# Altium schematic sheet Carte_Controle_Bras.SchDoc
size A3
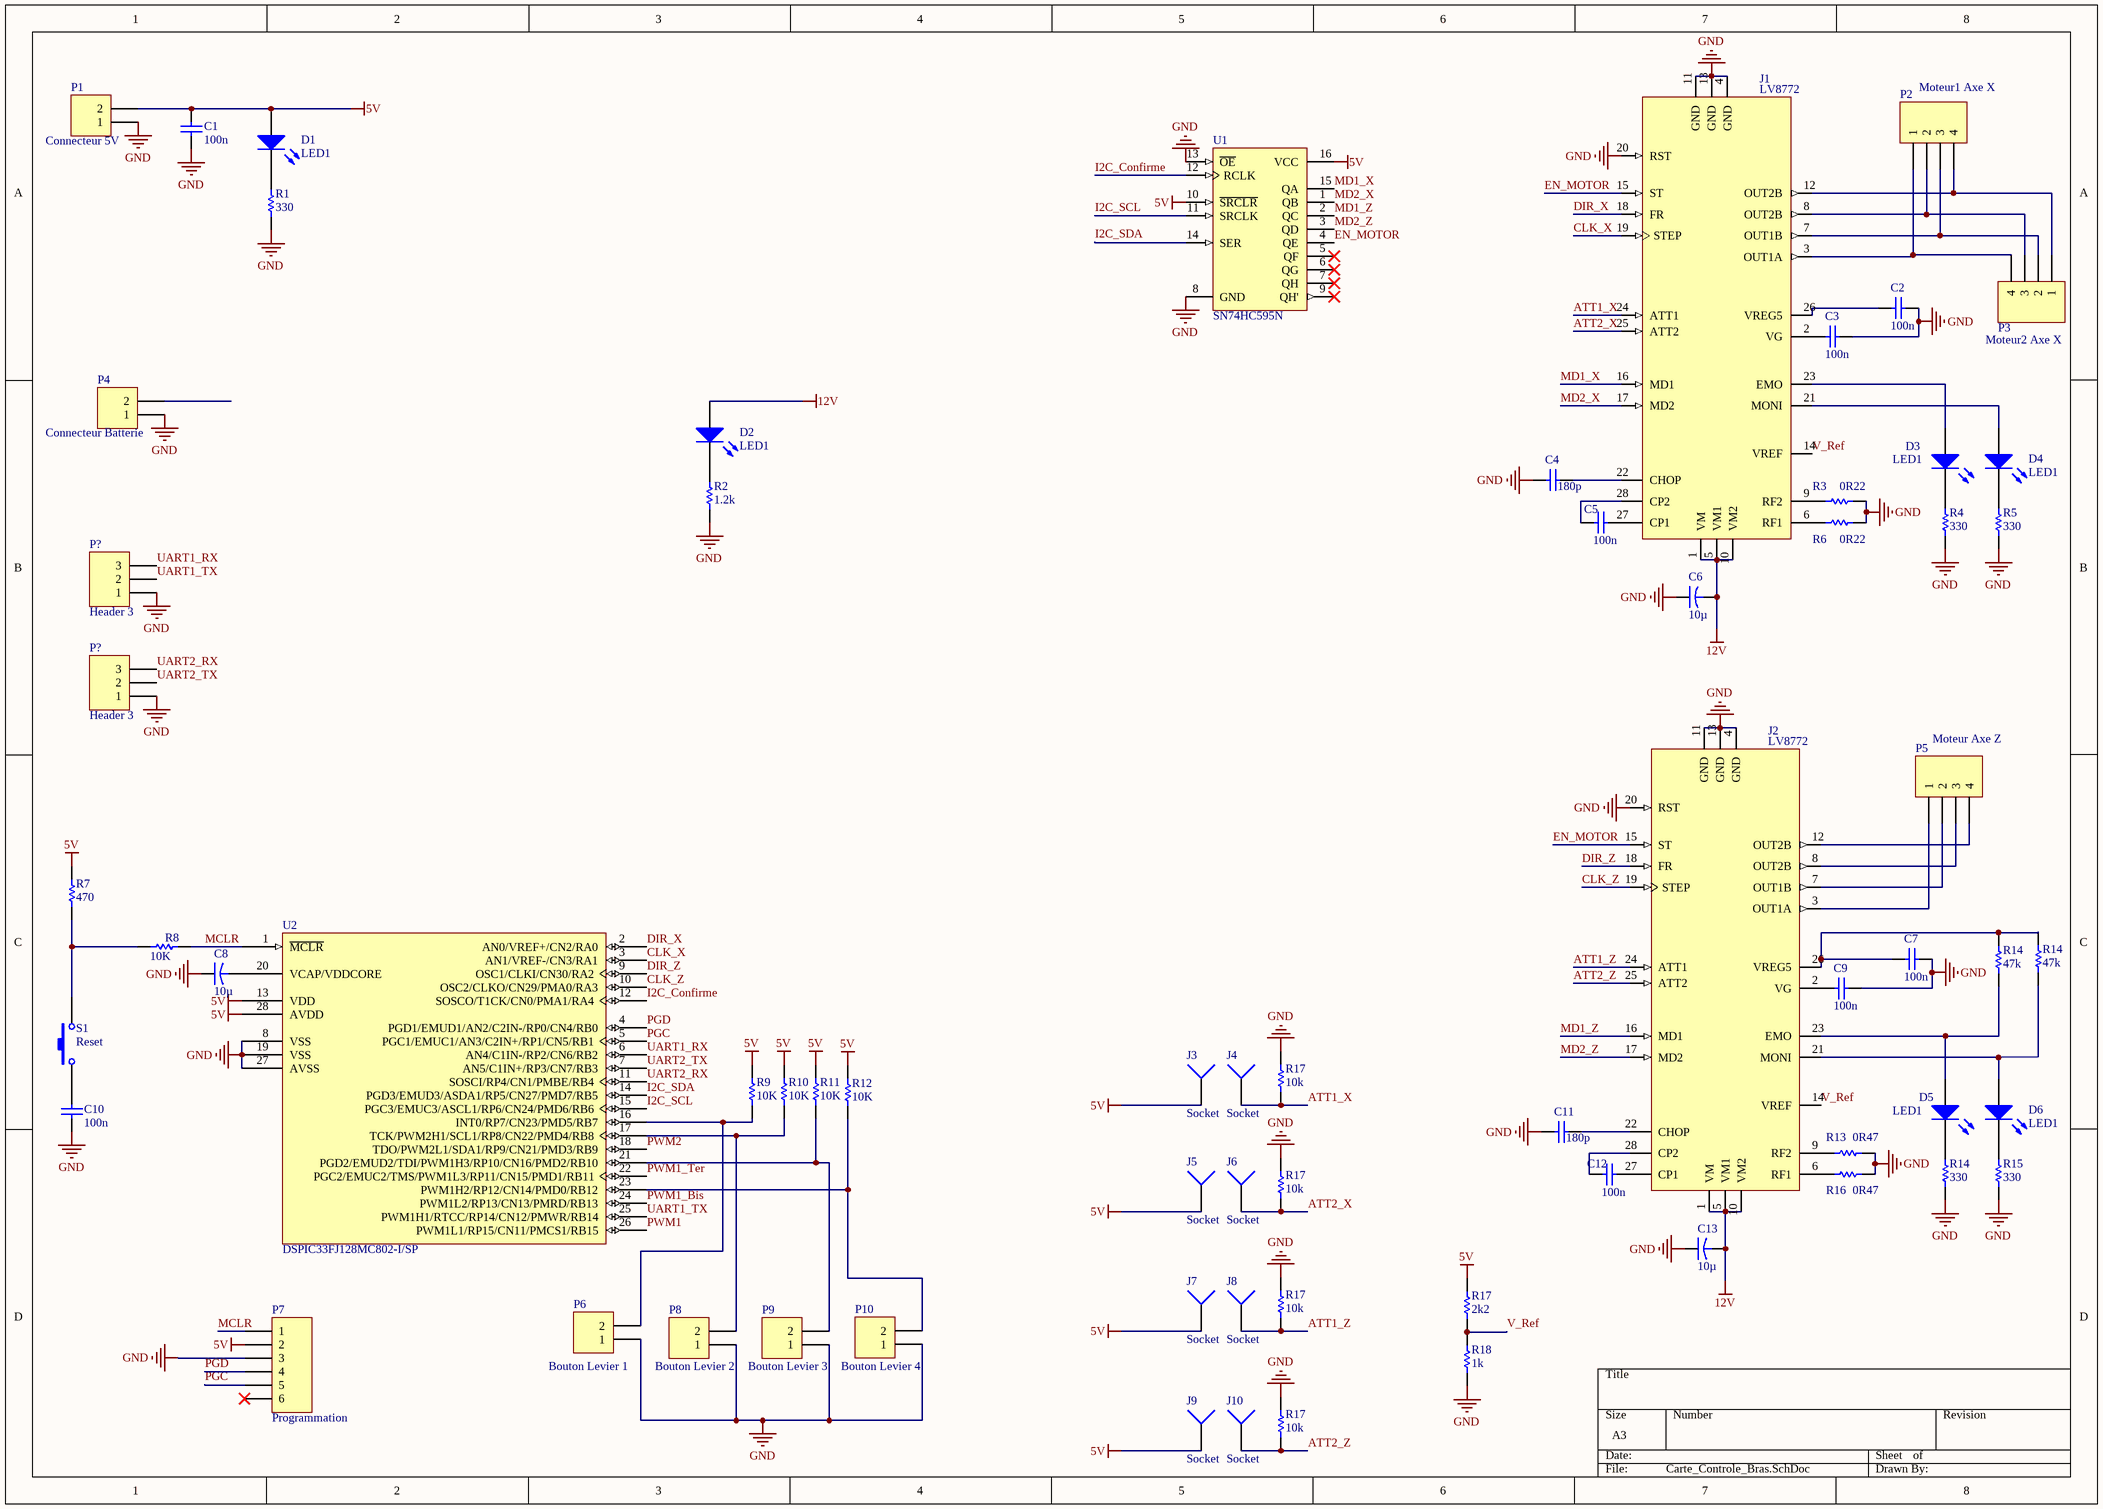
[diagram p0: Carte_Controle_Bras.SchDoc]

## Parts
(Parts that share a designator on the sheet are numbered #1, #2 ... from top to bottom, then left to right.)
C1  value 100n  [RAD-0.3]  (hidden comment: Cap)
C2  value 100n  [RAD-0.3]  (hidden comment: Cap)
C3  value 100n  [RAD-0.3]  (hidden comment: Cap)
C4  value 180p  [RAD-0.3]  (hidden comment: Cap)
C5  value 100n  [RAD-0.3]  (hidden comment: Cap)
C6  value 10µ  [CAPR5-4X5]  (hidden comment: Cap2)
C7  value 100n  [RAD-0.3]  (hidden comment: Cap)
C8  value 10µ  [CAPR5-4X5]  (hidden comment: Cap2)
C9  value 100n  [RAD-0.3]  (hidden comment: Cap)
C10  value 100n  [RAD-0.3]  (hidden comment: Cap)
C11  value 180p  [RAD-0.3]  (hidden comment: Cap)
C12  value 100n  [RAD-0.3]  (hidden comment: Cap)
C13  value 10µ  [CAPR5-4X5]  (hidden comment: Cap2)
D1  LED1  [C0805]
D2  LED1  [C0805]
D3  LED1  [C0805]
D4  LED1  [C0805]
D5  LED1  [C0805]
D6  LED1  [C0805]
J1  LV8772
J2  LV8772
J3  Socket  [PIN1]
J4  Socket  [PIN1]
J5  Socket  [PIN1]
J6  Socket  [PIN1]
J7  Socket  [PIN1]
J8  Socket  [PIN1]
J9  Socket  [PIN1]
J10  Socket  [PIN1]
P1  Connecteur 5V  [HDR1X2]
P2  Moteur1 Axe X  [HDR1X4]
P3  Moteur2 Axe X  [HDR1X4]
P4  Connecteur Batterie  [HDR1X2]
P5  Moteur Axe Z  [HDR1X4]
P6  Bouton Levier 1  [HDR1X2]
P7  Programmation  [HDR1X6]
P8  Bouton Levier 2  [HDR1X2]
P9  Bouton Levier 3  [HDR1X2]
P10  Bouton Levier 4  [HDR1X2]
P?#1  Header 3  [HDR1X3]
P?#2  Header 3  [HDR1X3]
R1  value 330  [AXIAL-0.3]  (hidden comment: Res1)
R2  value 1.2k  [AXIAL-0.3]  (hidden comment: Res1)
R3  value 0R22  [AXIAL-0.3]  (hidden comment: Res1)
R4  value 330  [AXIAL-0.3]  (hidden comment: Res1)
R5  value 330  [AXIAL-0.3]  (hidden comment: Res1)
R6  value 0R22  [AXIAL-0.3]  (hidden comment: Res1)
R7  value 470  [AXIAL-0.3]  (hidden comment: Res1)
R8  value 10K  [AXIAL-0.3]  (hidden comment: Res1)
R9  value 10K  [AXIAL-0.3]  (hidden comment: Res1)
R10  value 10K  [AXIAL-0.3]  (hidden comment: Res1)
R11  value 10K  [AXIAL-0.3]  (hidden comment: Res1)
R12  value 10K  [AXIAL-0.3]  (hidden comment: Res1)
R13  value 0R47  [AXIAL-0.3]  (hidden comment: Res1)
R14#1  value 47k  [AXIAL-0.3]  (hidden comment: Res1)
R14#2  value 47k  [AXIAL-0.3]  (hidden comment: Res1)
R14#3  value 330  [AXIAL-0.3]  (hidden comment: Res1)
R15  value 330  [AXIAL-0.3]  (hidden comment: Res1)
R16  value 0R47  [AXIAL-0.3]  (hidden comment: Res1)
R17#1  value 10k  [AXIAL-0.3]  (hidden comment: Res1)
R17#2  value 10k  [AXIAL-0.3]  (hidden comment: Res1)
R17#3  value 10k  [AXIAL-0.3]  (hidden comment: Res1)
R17#4  value 2k2  [AXIAL-0.3]  (hidden comment: Res1)
R17#5  value 10k  [AXIAL-0.3]  (hidden comment: Res1)
R18  value 1k  [AXIAL-0.3]  (hidden comment: Res1)
S1  Reset  [SPST-2]
U1  SN74HC595N  [N016]
U2  DSPIC33FJ128MC802-I/SP  [SPDIP300-SP28]

## Nets
5V: C1.1 D1.1(A) J3.1 J5.1 J7.1 J9.1 P1.2 P7.2 R7.2 R9.1 R10.1 R11.1 R12.1 R17#4.1 U1.10(~{SRCLR}) U1.16(VCC) U2.13(VDD) U2.28(AVDD)
12V: C6.2 C13.2 D2.1(A) J1.1(VM) J1.5(VM1) J1.10(VM2) J2.1(VM) J2.5(VM1) J2.10(VM2)
GND: C1.2 C2.2 C3.1 C4.2 C6.1 C7.2 C8.1 C9.1 C10.2 C11.2 C13.1 J1.4(GND) J1.11(GND) J1.13(GND) J1.20(RST) J2.4(GND) J2.11(GND) J2.13(GND) J2.20(RST) P1.1 P4.1 P6.1 P7.3 P8.1 P9.1 P10.1 P?#1.1 P?#2.1 R1.2 R2.2 R3.1 R4.2 R5.2 R6.1 R13.1 R14#3.2 R15.2 R16.1 R17#1.1 R17#2.1 R17#3.1 R17#5.1 R18.2 U1.8(GND) U1.13(~{OE}) U2.8(VSS) U2.19(VSS) U2.27(AVSS)
ATT1_X: J1.24(ATT1) J4.1 R17#1.2
ATT1_Z: J2.24(ATT1) J8.1 R17#3.2
ATT2_X: J1.25(ATT2) J6.1 R17#2.2
ATT2_Z: J2.25(ATT2) J10.1 R17#5.2
CLK_X: J1.19(STEP) U2.3(AN1/VREF-/CN3/RA1)
CLK_Z: J2.19(STEP) U2.10(OSC2/CLKO/CN29/PMA0/RA3)
DIR_X: J1.18(FR) U2.2(AN0/VREF+/CN2/RA0)
DIR_Z: J2.18(FR) U2.9(OSC1/CLKI/CN30/RA2)
EN_MOTOR: J1.15(ST) J2.15(ST) U1.4(QE)
I2C_Confirme: U1.12(RCLK) U2.12(SOSCO/T1CK/CN0/PMA1/RA4)
I2C_SCL: U1.11(SRCLK) U2.15(PGC3/EMUC3/ASCL1/RP6/CN24/PMD6/RB6)
I2C_SDA: U1.14(SER) U2.14(PGD3/EMUD3/ASDA1/RP5/CN27/PMD7/RB5)
MCLR: P7.1 R8.2 U2.1(~{MCLR})
MD1_X: J1.16(MD1) U1.15(QA)
MD1_Z: J2.16(MD1) U1.2(QC)
MD2_X: J1.17(MD2) U1.1(QB)
MD2_Z: J2.17(MD2) U1.3(QD)
PGC: P7.5 U2.5(PGC1/EMUC1/AN3/C2IN+/RP1/CN5/RB1)
PGD: P7.4 U2.4(PGD1/EMUD1/AN2/C2IN-/RP0/CN4/RB0)
PWM1: U2.26(PWM1L1/RP15/CN11/PMCS1/RB15)
PWM1_Bis: U2.24(PWM1L2/RP13/CN13/PMRD/RB13)
PWM1_Ter: U2.22(PGC2/EMUC2/TMS/PWM1L3/RP11/CN15/PMD1/RB11)
PWM2: U2.18(TDO/PWM2L1/SDA1/RP9/CN21/PMD3/RB9)
UART1_RX: P?#1.3 U2.6(AN4/C1IN-/RP2/CN6/RB2)
UART1_TX: P?#1.2 U2.25(PWM1H1/RTCC/RP14/CN12/PMWR/RB14)
UART2_RX: P?#2.3 U2.11(SOSCI/RP4/CN1/PMBE/RB4)
UART2_TX: P?#2.2 U2.7(AN5/C1IN+/RP3/CN7/RB3)
V_Ref: J1.14(VREF) J2.14(VREF) R17#4.2 R18.1
NetC2_1: C2.1 J1.26(VREG5)
NetC3_2: C3.2 J1.2(VG)
NetC4_1: C4.1 J1.22(CHOP)
NetC5_1: C5.1 J1.27(CP1)
NetC5_2: C5.2 J1.28(CP2)
NetC7_1: C7.1 J2.26(VREG5) R14#1.1 R14#2.1
NetC8_2: C8.2 U2.20(VCAP/VDDCORE)
NetC9_2: C9.2 J2.2(VG)
NetC10_1: C10.1 S1.1
NetC11_1: C11.1 J2.22(CHOP)
NetC12_1: C12.1 J2.27(CP1)
NetC12_2: C12.2 J2.28(CP2)
NetD1_2: D1.2(K) R1.1
NetD2_2: D2.2(K) R2.1
NetD3_1: D3.1(A) J1.23(EMO)
NetD3_2: D3.2(K) R4.1
NetD4_1: D4.1(A) J1.21(MONI)
NetD4_2: D4.2(K) R5.1
NetD5_1: D5.1(A) J2.23(EMO) R14#1.2
NetD5_2: D5.2(K) R14#3.1
NetD6_1: D6.1(A) J2.21(MONI) R14#2.2
NetD6_2: D6.2(K) R15.1
NetJ1_3: J1.3(OUT1A) P2.1 P3.4
NetJ1_6: J1.6(RF1) R6.2
NetJ1_7: J1.7(OUT1B) P2.3 P3.2
NetJ1_8: J1.8(OUT2B) P2.2 P3.3
NetJ1_9: J1.9(RF2) R3.2
NetJ1_12: J1.12(OUT2B) P2.4 P3.1
NetJ2_3: J2.3(OUT1A) P5.1
NetJ2_6: J2.6(RF1) R16.2
NetJ2_7: J2.7(OUT1B) P5.2
NetJ2_8: J2.8(OUT2B) P5.3
NetJ2_9: J2.9(RF2) R13.2
NetJ2_12: J2.12(OUT2B) P5.4
NetP6_2: P6.2 R9.2 U2.16(INT0/RP7/CN23/PMD5/RB7)
NetP8_2: P8.2 R10.2 U2.17(TCK/PWM2H1/SCL1/RP8/CN22/PMD4/RB8)
NetP9_2: P9.2 R11.2 U2.21(PGD2/EMUD2/TDI/PWM1H3/RP10/CN16/PMD2/RB10)
NetP10_2: P10.2 R12.2 U2.23(PWM1H2/RP12/CN14/PMD0/RB12)
NetR7_1: R7.1 R8.1 S1.2

Not connected (* = marked no-connect by the designer): P4 2; P7 6*; U1 5(QF)* 6(QG)* 7(QH)* 9(QH')*

## Library data of the parts
C1-C5 C7 C9-C12 = Cap: Capacitor; Published: 8-Jun-2000; LatestRevisionDate: 17-Jul-2002; LatestRevisionNote: Re-released for DXP Platform.; PackageReference: RAD-0.3; Publisher: Altium Limited
C6 C8 C13 = Cap2: Capacitor; Published: 23-Sep-2002; PackageReference: CAPR5-4X5; Publisher: Altium Limited
D1-D6 = LED1: Typical RED GaAs LED; Published: 8-Jun-2000; LatestRevisionDate: 08-Jul-2005; LatestRevisionNote: Mech Layer 1 removed.; PackageReference: LED-1; Publisher: Altium Limited
P1 P4 P6 P8-P10 = Header 2: Header, 2-Pin; LatestRevisionDate: 17-Jul-2002; LatestRevisionNote: Re-released for DXP Platform.; Publisher: Altium Limited
P2 P3 P5 = Header 4: Header, 4-Pin; LatestRevisionDate: 17-Jul-2002; LatestRevisionNote: Re-released for DXP Platform.; Publisher: Altium Limited
P7 = Header 6: Header, 6-Pin; LatestRevisionDate: 17-Jul-2002; LatestRevisionNote: Re-released for DXP Platform.; Publisher: Altium Limited
P?#1 P?#2 = Header 3: Header, 3-Pin; LatestRevisionDate: 17-Jul-2002; LatestRevisionNote: Re-released for DXP Platform.; Publisher: Altium Limited
R1-R13 R14#1-R14#3 R15 R16 R17#1-R17#5 R18 = Res1: Resistor; Published: 8-Jun-2000; LatestRevisionDate: 17-Jul-2002; LatestRevisionNote: Re-released for DXP Platform.; PackageReference: AXIAL-0.3; Publisher: Altium Limited
S1 = SW-PB: Switch; Published: 24-Mar-1999; LatestRevisionDate: 17-Jul-2002; LatestRevisionNote: Re-released for DXP Platform.; PackageReference: SPST-2; Publisher: Altium Limited; PackageDescription: Switch; 2 Leads
U1 = SN74HC595N: 8-Bit Shift Register with 3-State Output Registers; Published: 8-Jun-2000; LatestRevisionDate: 04-Mar-2005; LatestRevisionNote: Stylized 3D Model Added.; DatasheetVersion: May-1997; PackageVersion: Oct-1995; PackageReference: N016; Publisher: Altium Limited; PackageDescription: DIP; 16 Leads; Row Spacing 7.62 mm; Pitch 2.54 mm; Code_JEDEC: MS-001-BB; ComponentLink1Description: Manufacturer Link; ComponentLink1URL: http://www.ti.com/; ComponentLink2Description: Datasheet; ComponentLink2URL: http://www-s.ti.com/sc/ds/sn74hc595.pdf
U2 = DSPIC33FJ128MC802-I/SP: High-Performance 16-bit Digital Signal Controller, 128 KB Flash, 16 KB RAM, 28-Pin SPDIP, Industrial Temperature; FirstPublished: 29-Jan-2009; LatestRevisionDate: 02-Dec-2009; LatestRevisionNote: Updated to datasheet revision D, Nov-2009; DatasheetVersion: revD, Nov-2009; PackageVersion: revBB, Aug-2009; PackageReference: SPDIP300-SP28; Publisher: Altium Limited; PackageDescription: 28-Lead Skinny Plastic Dual In-Line (SP) - 300 mil Body [SPDIP]; Supplier 1: Digi-Key; Supplier Part Number 1: DSPIC33FJ128MC802-I/SP-ND; Supplier 2: Farnell; Supplier Part Number 2: 1576808; Supplier 3: Newark; Supplier Part Number 3: 39M8141; ComponentLink1Description: Datasheet; ComponentLink1URL: http://ww1.microchip.com/downloads/en/DeviceDoc/70291D.pdf; ComponentLink2Description: Packaging Specification; ComponentLink2URL: http://www.microchip.com/stellent/groups/techpub_sg/documents/packagingspec/en012702.pdf; ComponentLink3Description: Microchip.com Home; ComponentLink3URL: http://www.microchip.com/
J3-J10 = Socket: LatestRevisionDate: 17-Jul-2002; LatestRevisionNote: Re-released for DXP Platform.; Publisher: Altium Limited